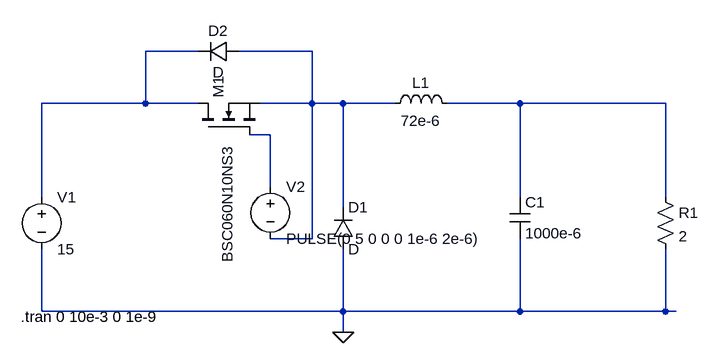
[diagram p0: schematic Draft1a.asc]
Draft1a.asc, the LTspice schematic file:
Version 4
SHEET 1 880 680
WIRE 0 -432 -80 -432
WIRE 176 -432 64 -432
WIRE -80 -352 -80 -432
WIRE -80 -352 -240 -352
WIRE 0 -352 -80 -352
WIRE 176 -352 176 -432
WIRE 176 -352 96 -352
WIRE 224 -352 176 -352
WIRE 304 -352 224 -352
WIRE 496 -352 384 -352
WIRE 720 -352 496 -352
WIRE 112 -304 80 -304
WIRE 112 -224 112 -304
WIRE -240 -208 -240 -352
WIRE 496 -208 496 -352
WIRE 720 -208 720 -352
WIRE 224 -192 224 -352
WIRE 176 -144 176 -352
WIRE 176 -144 112 -144
WIRE -240 -32 -240 -128
WIRE 224 -32 224 -128
WIRE 224 -32 -240 -32
WIRE 496 -32 496 -144
WIRE 496 -32 224 -32
WIRE 720 -32 720 -128
WIRE 720 -32 496 -32
WIRE 736 -32 720 -32
WIRE 224 0 224 -32
FLAG 224 0 0
SYMBOL nmos 0 -304 R270
WINDOW 3 -196 46 Left 2
SYMATTR Value BSC060N10NS3
SYMATTR InstName M1
SYMBOL voltage -240 -224 R0
WINDOW 123 0 0 Left 2
WINDOW 39 0 0 Left 2
SYMATTR InstName V1
SYMATTR Value 15
SYMBOL ind 288 -336 R270
WINDOW 0 32 56 VTop 2
WINDOW 3 5 56 VBottom 2
SYMATTR InstName L1
SYMATTR Value 72e-6
SYMBOL cap 480 -208 R0
SYMATTR InstName C1
SYMATTR Value 1000e-6
SYMBOL res 704 -224 R0
SYMATTR InstName R1
SYMATTR Value 2
SYMBOL diode 208 -128 M180
WINDOW 0 24 64 Left 2
WINDOW 3 24 0 Left 2
SYMATTR InstName D1
SYMBOL diode 64 -448 R90
WINDOW 0 0 32 VBottom 2
WINDOW 3 32 32 VTop 2
SYMATTR InstName D2
SYMBOL voltage 112 -240 R0
WINDOW 123 0 0 Left 2
WINDOW 39 0 0 Left 2
SYMATTR InstName V2
SYMATTR Value PULSE(0 5 0 0 0 1e-6 2e-6)
TEXT -272 -24 Left 2 !.tran 0 10e-3 0 1e-9

The netlist it stands for:
* Draft1a.asc
M1 N001 N004 N002 N002 BSC060N10NS3
V1 N001 0 15
L1 N002 N003 72e-6
C1 N003 0 1000e-6
R1 N003 0 2
D1 0 N002 D
D2 N002 N001 D
V2 N004 N002 PULSE(0 5 0 0 0 1e-6 2e-6)
.model D D
.lib standard.dio
.model NMOS NMOS
.model PMOS PMOS
.lib standard.mos
.tran 0 10e-3 0 1e-9
.backanno
.end